# Altium schematic sheet Shutdown_2019_v1.1_0.SchDoc: Shutdown_2019_v1.1
size 453 x 301 mm; Date: 1/4/2019 10:42:13 PM; SheetNumber: 1; GateName_1: G$1; SymbolName_1: FRAME_B_L; LibraryName: frames; DeviceSetName: FRAME_B_L; GateName_2: G$2; SymbolName_2: DOCFIELD
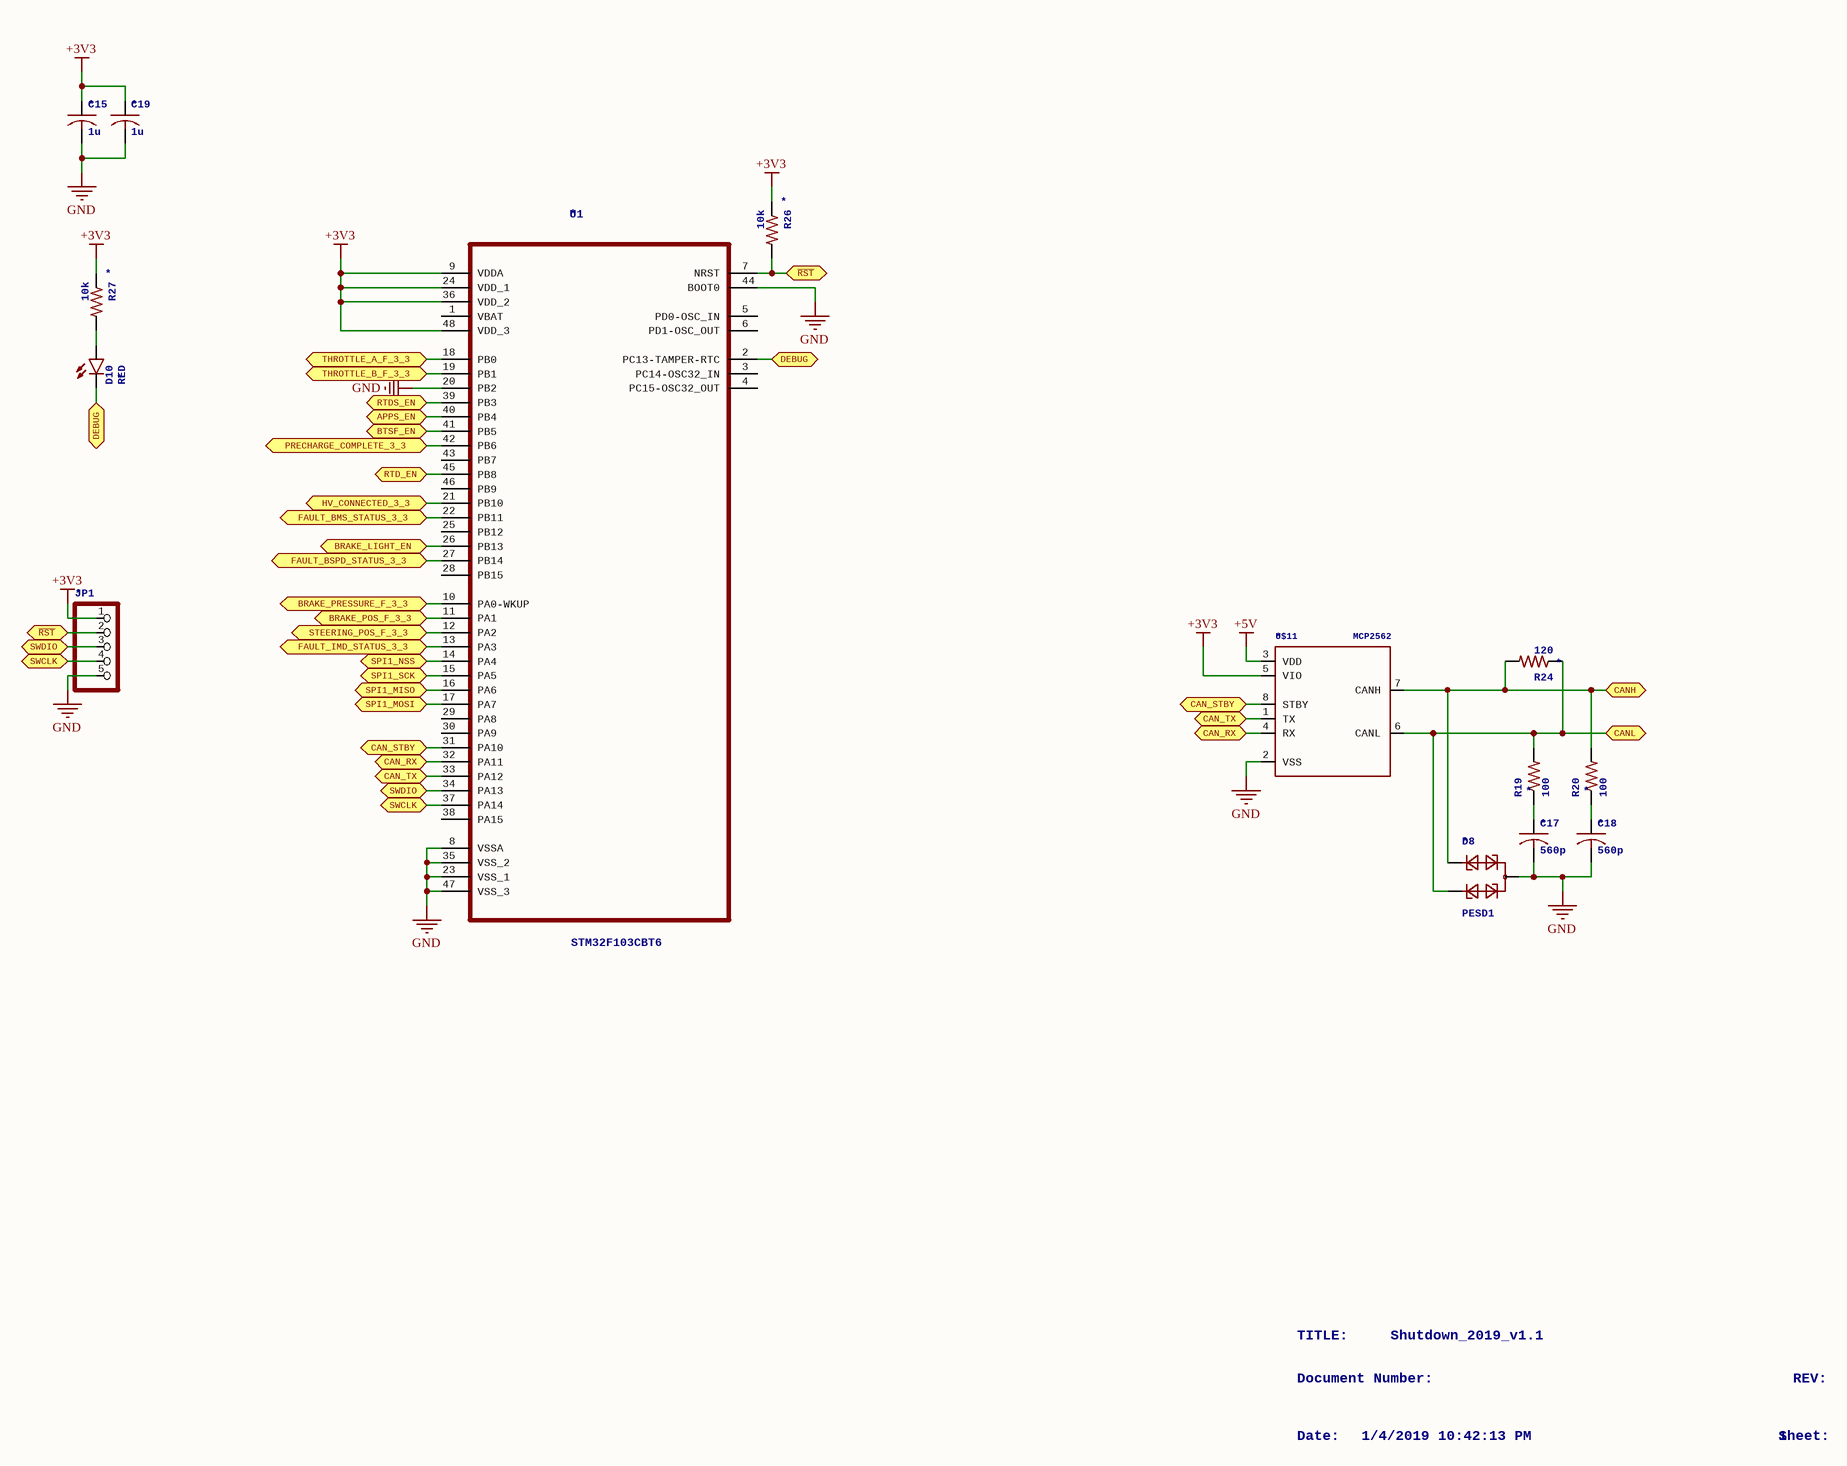
[diagram p0: Shutdown_2019_v1.1_0.SchDoc]

## Parts
C15  1u  [C0805]
C17  560p  [C0603]
C18  560p  [C0603]
C19  1u  [C0805]
D8  PESD1  [SOT23]
D10  RED  [LED-0603]
JP1  PINHD-1X5  [1X05]  (value not drawn)
R19  100  [R0603]
R20  100  [R0603]
R24  120  [R0603]
R26  10k  [R0603]
R27  10k  [R0603]
U1  STM32F103CBT6  [QFP50P900X900X160-48N]
U$11  MCP2562  [SOIC8]

## Ports
APPS_EN, BRAKE_LIGHT_EN, BRAKE_POS_F_3_3, BRAKE_PRESSURE_F_3_3, BTSF_EN, CAN_RX, CAN_STBY, CAN_TX, CANH, CANL, DEBUG, FAULT_BMS_STATUS_3_3, FAULT_BSPD_STATUS_3_3, FAULT_IMD_STATUS_3_3, HV_CONNECTED_3_3, PRECHARGE_COMPLETE_3_3, RTD_EN, RTDS_EN, SPI1_MISO, SPI1_MOSI, SPI1_NSS, SPI1_SCK, STEERING_POS_F_3_3, SWCLK, SWDIO, THROTTLE_A_F_3_3, THROTTLE_B_F_3_3, ~{RST}

## Nets
+3V3: C15.1 C19.1 JP1.1 R26.1 R27.1 U1.9(VDDA) U1.24(VDD_1) U1.36(VDD_2) U1.48(VDD_3) U$11.5(VIO)
+5V: U$11.3(VDD)
GND: C15.2 C17.2 C18.2 C19.2 D8.3 JP1.5 U1.8(VSSA) U1.20(PB2) U1.23(VSS_1) U1.35(VSS_2) U1.44(BOOT0) U1.47(VSS_3) U$11.2(VSS)
APPS_EN: U1.40(PB4) ; port APPS_EN
BRAKE_LIGHT_EN: U1.26(PB13) ; port BRAKE_LIGHT_EN
BRAKE_POS_F_3_3: U1.11(PA1) ; port BRAKE_POS_F_3_3
BRAKE_PRESSURE_F_3_3: U1.10(PA0-WKUP) ; port BRAKE_PRESSURE_F_3_3
BTSF_EN: U1.41(PB5) ; port BTSF_EN
CAN_RX: U1.32(PA11) U$11.4(RX) ; port CAN_RX
CAN_STBY: U1.31(PA10) U$11.8(STBY) ; port CAN_STBY
CAN_TX: U1.33(PA12) U$11.1(TX) ; port CAN_TX
CANH: D8.1 R20.2 R24.2 U$11.7(CANH) ; port CANH
CANL: D8.2 R19.2 R24.1 U$11.6(CANL) ; port CANL
DEBUG: D10.C U1.2(PC13-TAMPER-RTC) ; port DEBUG
FAULT_BMS_STATUS_3_3: U1.22(PB11) ; port FAULT_BMS_STATUS_3_3
FAULT_BSPD_STATUS_3_3: U1.27(PB14) ; port FAULT_BSPD_STATUS_3_3
FAULT_IMD_STATUS_3_3: U1.13(PA3) ; port FAULT_IMD_STATUS_3_3
HV_CONNECTED_3_3: U1.21(PB10) ; port HV_CONNECTED_3_3
PRECHARGE_COMPLETE_3_3: U1.42(PB6) ; port PRECHARGE_COMPLETE_3_3
~{RST}: JP1.2 R26.2 U1.7(NRST) ; port ~{RST}
RTD_EN: U1.45(PB8) ; port RTD_EN
RTDS_EN: U1.39(PB3) ; port RTDS_EN
SPI1_MISO: U1.16(PA6) ; port SPI1_MISO
SPI1_MOSI: U1.17(PA7) ; port SPI1_MOSI
SPI1_NSS: U1.14(PA4) ; port SPI1_NSS
SPI1_SCK: U1.15(PA5) ; port SPI1_SCK
STEERING_POS_F_3_3: U1.12(PA2) ; port STEERING_POS_F_3_3
SWCLK: JP1.4 U1.37(PA14) ; port SWCLK
SWDIO: JP1.3 U1.34(PA13) ; port SWDIO
THROTTLE_A_F_3_3: U1.18(PB0) ; port THROTTLE_A_F_3_3
THROTTLE_B_F_3_3: U1.19(PB1) ; port THROTTLE_B_F_3_3
NetC17_1: C17.1 R19.1
NetC18_1: C18.1 R20.1
NetD10_A: D10.A R27.2

Not connected (* = marked no-connect by the designer): U1 1(VBAT) 3(PC14-OSC32_IN) 4(PC15-OSC32_OUT) 5(PD0-OSC_IN) 6(PD1-OSC_OUT) 25(PB12) 28(PB15) 29(PA8) 30(PA9) 38(PA15) 43(PB7) 46(PB9)

## Notes on the sheet
- TITLE:
- Document Number:
- Shutdown_2019_v1.1
- REV:
- Date:
- 1/4/2019 10:42:13 PM
- Sheet:
- 1
- 2
- 3
- 4
- 5
- 6
- 7
- 8
- 9
- A
- B
- C
- D
- E
- F

## Library data of the parts
C15 C19 = C-USC0805: CAPACITOR, American symbol; GateName_1: G$1; SymbolName_1: C-US; DeviceName: C0805; LibraryName: rcl; DeviceSetName: C-US; NAME: *; SPICEPREFIX: C
C17 C18 = C-USC0603: CAPACITOR, American symbol; GateName_1: G$1; SymbolName_1: C-US; DeviceName: C0603; LibraryName: rcl; DeviceSetName: C-US; NAME: *; SPICEPREFIX: C
D8 = PESD1CAN: CAN bus ESD protection diodeSource: http://www.nxp.com/documents/data_sheet/PESD1CAN.pdf; GateName_1: G$1; SymbolName_1: PESD1CAN; LibraryName: diode; DeviceSetName: PESD1CAN; NAME: *
D10 = LED-RED0603: Assorted Red LEDsLilyPad 1206- DIO-099121206- DIO-008090603- DIO-00819"SMART" means more efficient and expensive; GateName_1: G$1; SymbolName_1: LED; DeviceName: 0603; LibraryName: SparkFun-LED; DeviceSetName: LED-RED; NAME: *; PROD_ID: DIO-00819
JP1 = PINHD-1X5: PIN HEADER; GateName_1: A; SymbolName_1: PINHD5; LibraryName: Headers_IFE; DeviceSetName: PINHD-1X5; NAME: *
R19 R20 R24 R26 R27 = R-US_R0603: RESISTOR, American symbol; GateName_1: G$1; SymbolName_1: R-US; DeviceSetName: R-US_; DeviceName: R0603; LibraryName: rcl; NAME: *; SPICEPREFIX: R
U1 = STM32F103CBT6: Medium-density performance line ARM-based 32-bit MCU; GateName_1: A; SymbolName_1: STM32F103CBT6; LibraryName: ST Microelctronics_By_element14_Batch_1; DeviceSetName: STM32F103CBT6; MPN: STM32F103CBT6; NAME: *; OC_FARNELL: 1606327; OC_NEWARK: 11N8296; PACKAGE: QFP-48; SUPPLIER: STMICROELECTRONICS
U$11 = MCP2562: MCP2562 High Speed CAN Tranceiver The MCP2561/2 is Microchip Technology Inc. second generation high-speed CAN transceiver. It serves as an interface between a CAN protocol controller and the physical two-wire CAN bus. The device meets the automotive requirements for high-speed (1 Mb/s), low quiescent current, electromagnetic compatibility (EMC) and electrostatic discharge (ESD). The device family members are: â€¢ MCP2561 with SPLIT pin â€¢ MCP2562 with VIO pin DatasheetMicrochipDigikey; GateName_1: G$1; SymbolName_1: MCP2562; LibraryName: MICROCHIP; DeviceSetName: MCP2562; NAME: *